# EAGLE board dsp (EAGLE 6.6.0)
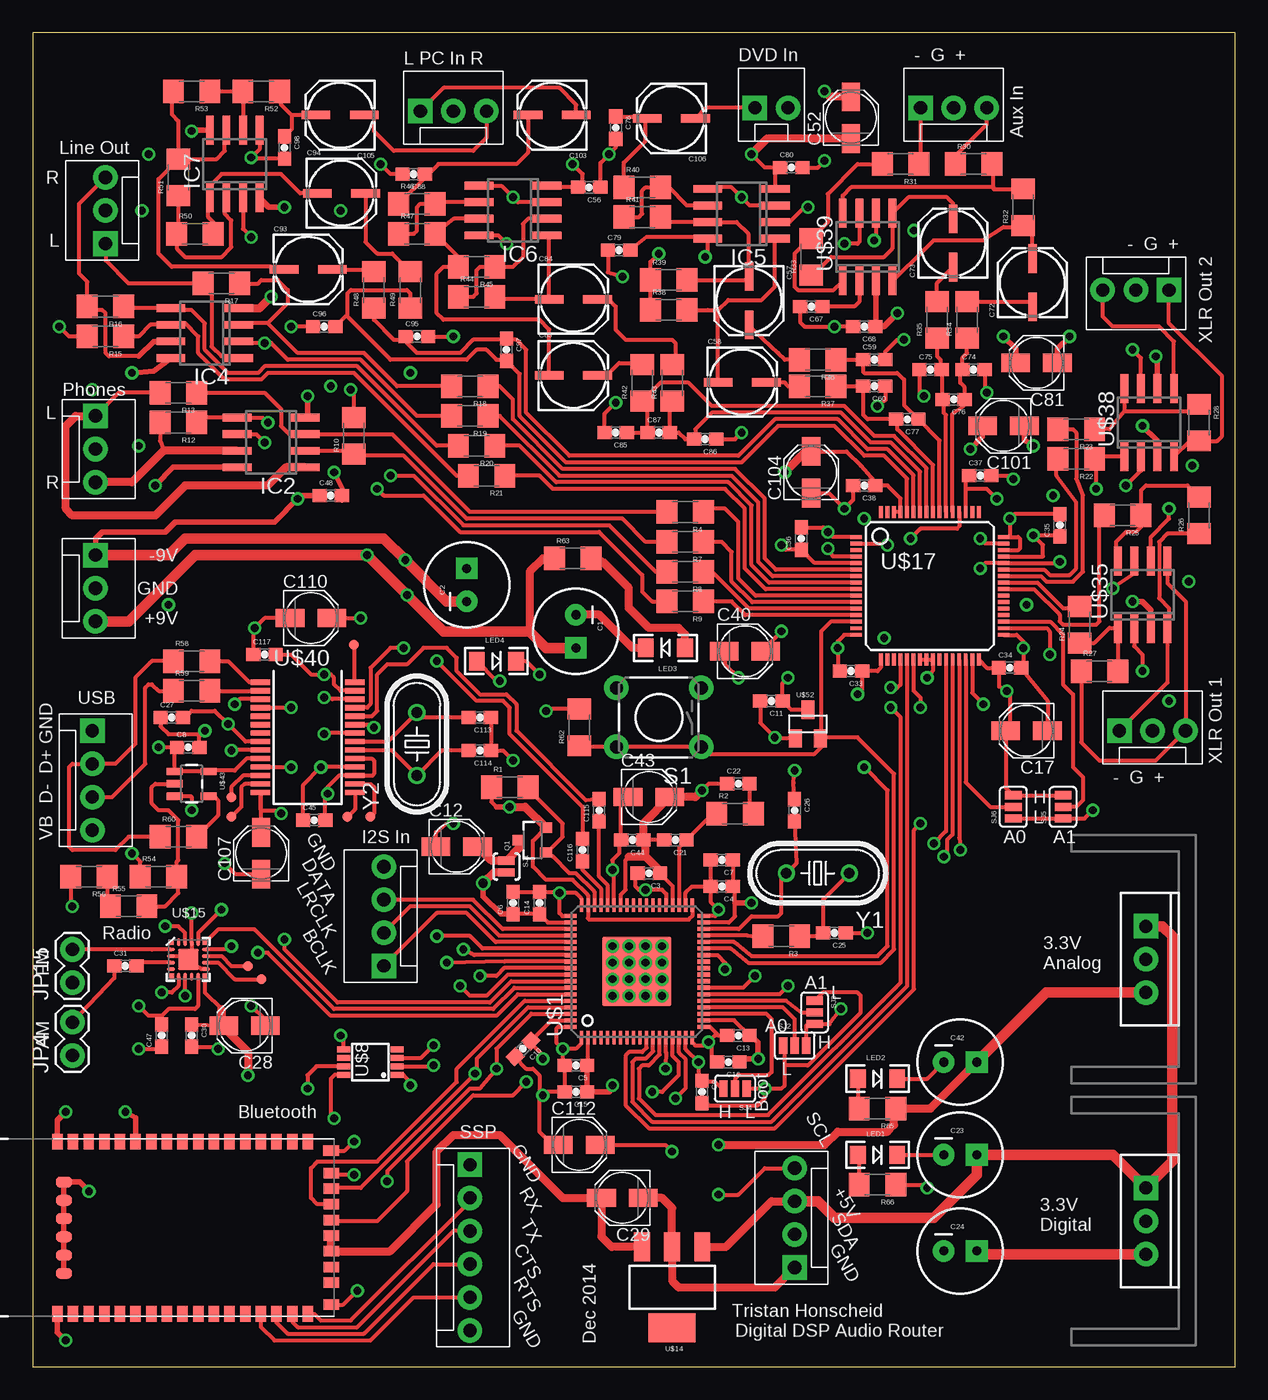
[diagram p2: board, top side]
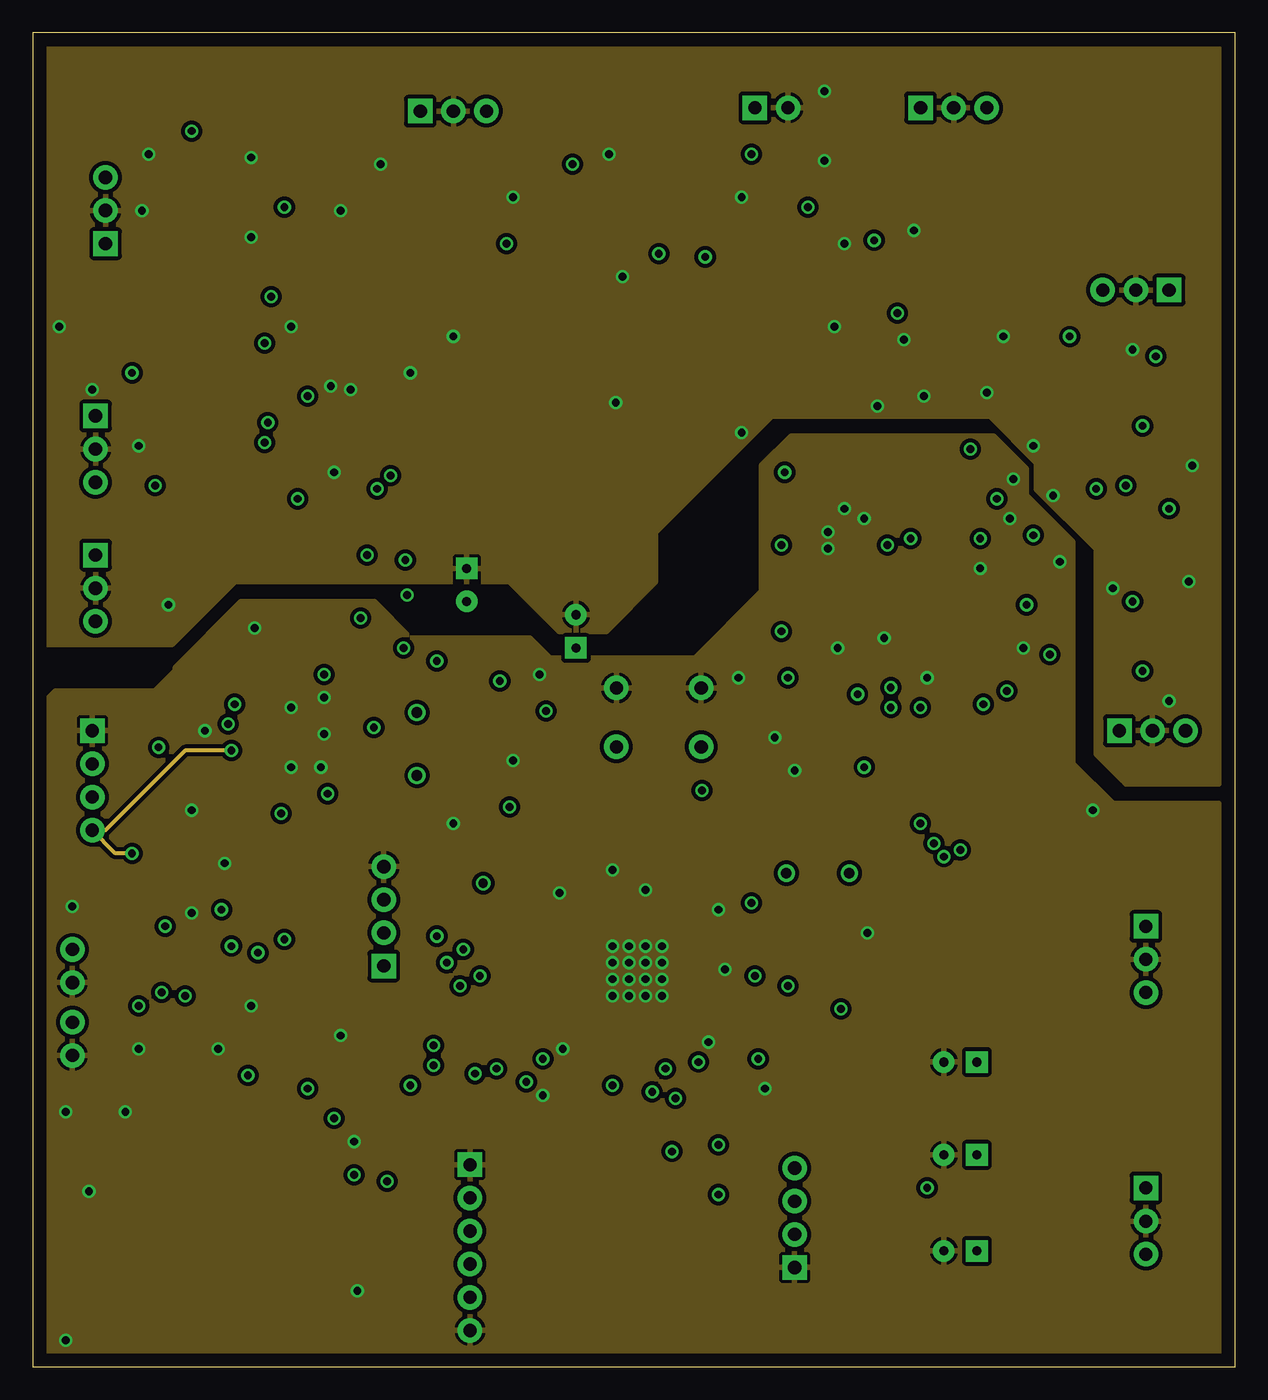
[diagram p3: board, inner layer Route2]
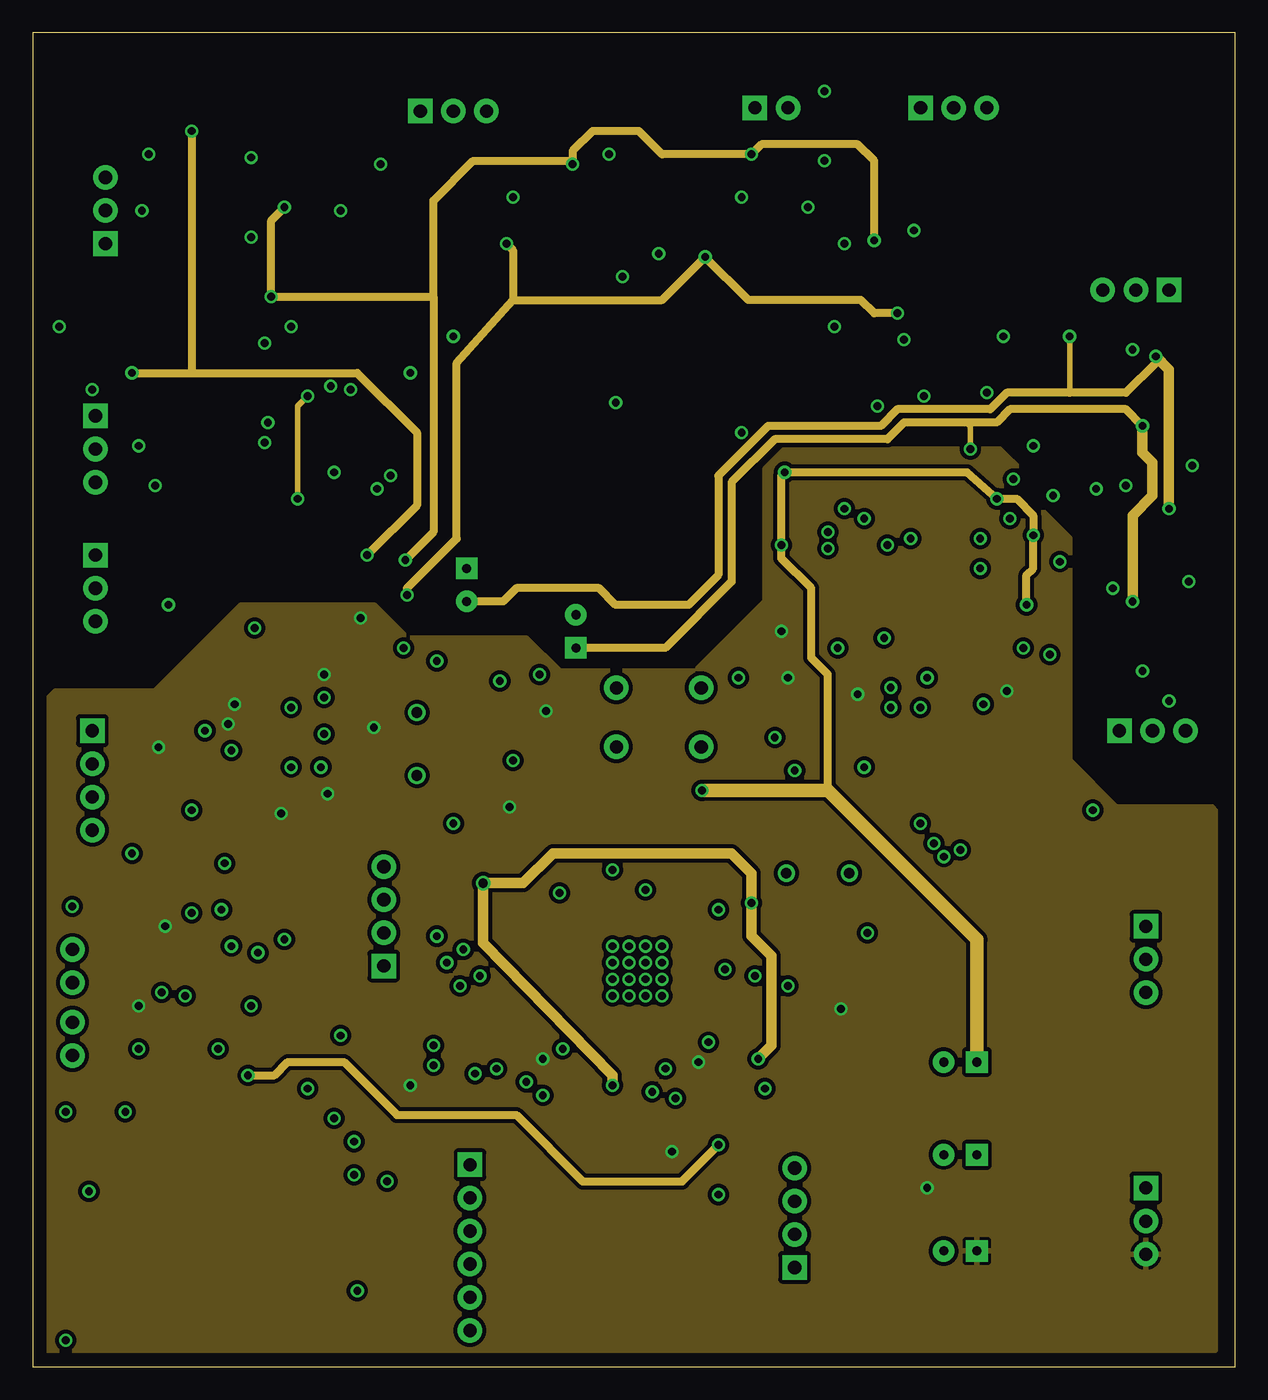
[diagram p4: board, inner layer Route15]
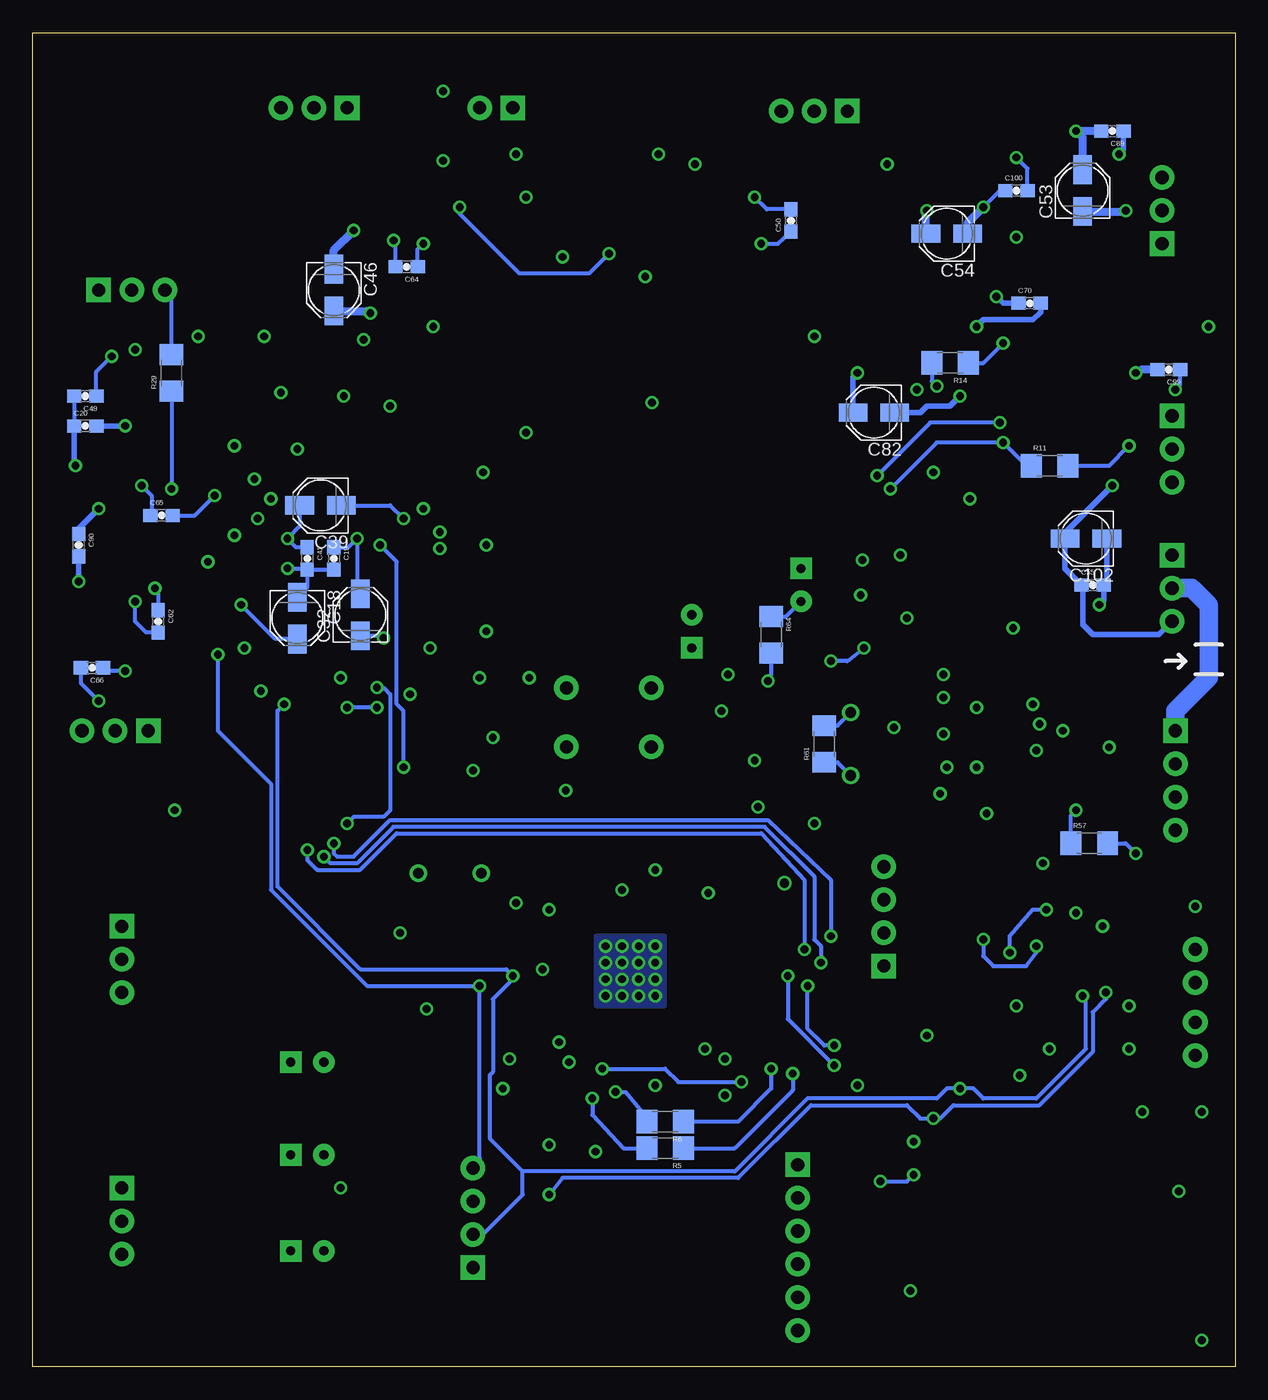
[diagram p5: board, bottom side, seen from below]

Size 92.18 x 102.29 mm. Coordinates in mm from the lower left corner, seen from the top.
Outline: 0,0 92.18,0 92.18,102.29 0,102.29 0,0
Copper layers (1*2*15*16): Top 0.035mm / dielectric 1.5mm / Route2 0.035mm / dielectric 0.15mm / Route15 0.035mm / dielectric 0.2mm / Bottom 0.035mm
Design rules "default *": minimum track width 10mil, minimum drill 15mil, track to track 5mil, track to pad 5mil, pad to pad 5mil, via to via 5mil, smd to smd 5mil, copper to edge 40mil, drill to drill 8mil, minimum pad ring 10mil, minimum via ring 8mil, stop-mask expansion 4mil, vias tented up to drill 0mil, thermal gap 10mil

## Footprints (pad centres in the part's own frame; a part is rotated, then mirrored left to right if it is on the bottom)
CPOL-RADIAL-100UF-25V = drill 0.7 pad 1.651 square: 1 1.27,0 | drill 0.7 pad 1.651: 2 -1.27,0
0603-CAP = smd 1.1 x 1: 1 -0.85,0; 2 0.85,0
PANASONIC_B = smd 2.2 x 1.4: + 1.6,0; - -1.6,0
PANASONIC_C = smd 2.2 x 0.65: + 1.9,-0.2; - -1.8,-0.2
TO220-IGO = drill 1 pad 1.88: GND 0,0; OUT 2.54,0 | drill 1 pad 1.88 square: IN -2.54,0
SO08 = smd 0.6 x 2.2: 1 -1.905,-2.6; 2 -0.635,-2.6; 3 0.635,-2.6; 4 1.905,-2.6; 5 1.905,2.6; 6 0.635,2.6; 7 -0.635,2.6; 8 -1.905,2.6
MOLEX-1X3 = drill 1.016 pad 1.88 square: 1 0,0 | drill 1.016 pad 1.88: 2 2.54,0; 3 5.08,0
MOLEX-1X6 = drill 1.016 pad 1.88 square: 1 0,0 | drill 1.016 pad 1.88: 2 2.54,0; 3 5.08,0; 4 7.62,0; 5 10.16,0; 6 12.7,0
1X02 = drill 1.016 pad 1.88: 1 0,0; 2 2.54,0
MOLEX-1X4 = drill 1.016 pad 1.88 square: 1 0,0 | drill 1.016 pad 1.88: 2 2.54,0; 3 5.08,0; 4 7.62,0
MOLEX-1X2 = drill 1.016 pad 1.88 square: 1 0,0 | drill 1.016 pad 1.88: 2 2.54,0
LED-1206 = smd 1.2 x 1.4: A -1.5,0; C 1.5,0
SOT23-3 = smd 0.8 x 0.9: 1 -0.95,-1; 2 0.95,-1; 3 0,1.1
1206 = smd 1.6 x 1.8: 1 -1.4,0; 2 1.4,0
TACTILE-PTH = drill 1.016 pad 1.88: 1 -3.251,2.261; 2 3.251,2.261; 3 -3.251,-2.261; 4 3.251,-2.261
SJ_2S-NO = smd 0.635 x 1.27: 1 -0.45,0; 2 0.45,0
SJ_3 = smd 0.635 x 1.27: 1 -0.889,0; 2 0,0; 3 0.889,0
PAD.03X.03 = smd 0.762 x 0.762: P$1 0,0
LFCSP-72 = smd 1 x 0.3: 1 5.675,3.65; 2 5.675,3.15; 3 5.675,2.65; 4 5.675,2.15; 5 5.675,1.65; 6 5.675,1.15; 7 5.675,0.65; 8 5.675,0.15; 9 5.675,-0.35; 10 5.675,-0.85; 11 5.675,-1.35; 12 5.675,-1.85; 13 5.675,-2.35; 14 5.675,-2.85; 15 5.675,-3.35; 16 5.675,-3.85; 017 5.675,-4.35; 018 5.675,-4.85; 037 -4.475,-4.85; 038 -4.475,-4.35; 039 -4.475,-3.85; 040 -4.475,-3.35; 041 -4.475,-2.85; 042 -4.475,-2.35; 043 -4.475,-1.85; 044 -4.475,-1.35; 045 -4.475,-0.85; 046 -4.475,-0.35; 047 -4.475,0.15; 048 -4.475,0.65; 049 -4.475,1.15; 050 -4.475,1.65; 051 -4.475,2.15; 052 -4.475,2.65; 053 -4.475,3.15; 054 -4.475,3.65 | smd 0.3 x 1: 019 4.85,-5.725; 020 4.35,-5.725; 021 3.85,-5.725; 022 3.35,-5.725; 023 2.85,-5.725; 024 2.35,-5.725; 025 1.85,-5.725; 026 1.35,-5.725; 027 0.85,-5.725; 028 0.35,-5.725; 029 -0.15,-5.725; 030 -0.65,-5.725; 031 -1.15,-5.725; 032 -1.65,-5.725; 033 -2.15,-5.725; 034 -2.65,-5.725; 035 -3.15,-5.725; 036 -3.65,-5.725; 055 -3.65,4.475; 056 -3.15,4.475; 057 -2.65,4.475; 058 -2.15,4.475; 059 -1.65,4.475; 060 -1.15,4.475; 061 -0.65,4.475; 062 -0.15,4.475; 063 0.35,4.475; 064 0.85,4.475; 065 1.35,4.475; 066 1.85,4.475; 067 2.35,4.475; 068 2.85,4.475; 069 3.35,4.475; 070 3.85,4.475; 071 4.35,4.475; 072 4.85,4.475 | smd 5.3 x 5.3: EXP 0.6,-0.6
MSOP-8 = smd 0.45 x 1: 1 -0.975,-2.05; 2 -0.325,-2.05; 3 0.325,-2.05; 4 0.975,-2.05; 5 0.975,2.05; 6 0.325,2.05; 7 -0.325,2.05; 8 -0.975,2.05
RN-52 = smd 1.2 x 0.8: 1 -6.6,8.33; 2 -6.6,7.13; 3 -6.6,5.93; 4 -6.6,4.73; 5 -6.6,3.53; 6 -6.6,2.33; 7 -6.6,1.13; 8 -6.6,-0.07; 9 -6.6,-1.27; 10 -6.6,-2.47; 11 -6.6,-3.67; 12 -6.6,-4.87; 13 -6.6,-6.07; 14 -6.6,-7.27; 15 -6.6,-8.47; 16 -6.6,-9.67; 25 6.6,-9.67; 26 6.6,-8.47; 27 6.6,-7.27; 28 6.6,-6.07; 29 6.6,-4.87; 30 6.6,-3.67; 31 6.6,-2.47; 32 6.6,-1.27; 33 6.6,-0.07; 34 6.6,1.13; 35 6.6,2.33; 36 6.6,3.53; 37 6.6,4.73; 38 6.6,5.93; 39 6.6,7.13; 40 6.6,8.33; G1 -6.6,9.53; G4 6.6,9.53 | smd 0.8 x 1.2: 17 -4.2,-11.47; 18 -3,-11.47; 19 -1.8,-11.47; 20 -0.6,-11.47; 21 0.6,-11.47; 22 1.8,-11.47; 23 3,-11.47; 24 4.2,-11.47; G2 -5.9,-11.47; G3 5.9,-11.46; RFG1 -3.5,9.03; RFG2 -2.1,9.03; RFG3 -0.7,9.03; RFG4 0.7,9.03; RFG5 2.1,9.03; RFG6 3.5,9.03
SOT223 = smd 1.219 x 2.235: 1 -2.311,-3.099; 2 0,-3.099; 3 2.311,-3.099 | smd 3.6 x 2.2: 4 0,3.099
QFN-16 = smd 0.34 x 0.34: 1 -0.005,-0.005; 6 0.005,-2.535; 11 2.535,-2.535; 16 2.535,-0.005 | smd 0.61 x 0.28: 2 -0.065,-0.52; 3 -0.065,-1.02; 4 -0.065,-1.52; 5 -0.065,-2.02; 12 2.605,-2.02; 13 2.605,-1.52; 14 2.605,-1.02; 15 2.605,-0.52 | smd 0.28 x 0.61: 7 0.52,-2.605; 8 1.02,-2.605; 9 1.52,-2.605; 10 2.02,-2.605; 17 2.02,0.065; 18 1.52,0.065; 19 1.02,0.065; 20 0.52,0.065 | smd 1.6 x 1.6: 21 1.27,-1.27
LQFP-64 = smd 0.9 x 0.3: 1 -5.45,3.68; 2 -5.45,3.18; 3 -5.45,2.68; 4 -5.45,2.18; 5 -5.45,1.68; 6 -5.45,1.18; 7 -5.45,0.68; 8 -5.45,0.18; 9 -5.45,-0.32; 10 -5.45,-0.82; 11 -5.45,-1.32; 12 -5.45,-1.82; 13 -5.45,-2.32; 14 -5.45,-2.82; 15 -5.45,-3.32; 16 -5.45,-3.82; 33 5.85,-3.82; 34 5.85,-3.32; 35 5.85,-2.82; 36 5.85,-2.32; 37 5.85,-1.82; 38 5.85,-1.32; 39 5.85,-0.82; 40 5.85,-0.32; 41 5.85,0.18; 42 5.85,0.68; 43 5.85,1.18; 44 5.85,1.68; 45 5.85,2.18; 46 5.85,2.68; 47 5.85,3.18; 48 5.85,3.68 | smd 0.3 x 0.9: 17 -3.55,-5.72; 18 -3.05,-5.72; 19 -2.55,-5.72; 20 -2.05,-5.72; 21 -1.55,-5.72; 22 -1.05,-5.72; 23 -0.55,-5.72; 24 -0.05,-5.72; 25 0.45,-5.72; 26 0.95,-5.72; 27 1.45,-5.72; 28 1.95,-5.72; 29 2.45,-5.72; 30 2.95,-5.72; 31 3.45,-5.72; 32 3.95,-5.72; 49 3.95,5.58; 50 3.45,5.58; 51 2.95,5.58; 52 2.45,5.58; 53 1.95,5.58; 54 1.45,5.58; 55 0.95,5.58; 56 0.45,5.58; 57 -0.05,5.58; 58 -0.55,5.58; 59 -1.05,5.58; 60 -1.55,5.58; 61 -2.05,5.58; 62 -2.55,5.58; 63 -3.05,5.58; 64 -3.55,5.58
SOIC-8 = smd 0.6 x 2.2: 1 -1.905,-2.6; 2 -0.635,-2.6; 3 0.635,-2.6; 4 1.905,-2.6; 5 1.905,2.6; 6 0.635,2.6; 7 -0.635,2.6; 8 -1.905,2.6
SSOP-28 = smd 0.4 x 1.5: 1 -4.225,-3.625; 2 -3.575,-3.625; 3 -2.925,-3.625; 4 -2.275,-3.625; 5 -1.625,-3.625; 6 -0.975,-3.625; 7 -0.325,-3.625; 8 0.325,-3.625; 9 0.975,-3.625; 10 1.625,-3.625; 11 2.275,-3.625; 12 2.925,-3.625; 13 3.575,-3.625; 14 4.225,-3.625; 15 4.225,3.625; 16 3.575,3.625; 17 2.925,3.625; 18 2.275,3.625; 19 1.625,3.625; 20 0.975,3.625; 21 0.325,3.625; 22 -0.325,3.625; 23 -0.975,3.625; 24 -1.625,3.625; 25 -2.275,3.625; 26 -2.925,3.625; 27 -3.575,3.625; 28 -4.225,3.625
SOT23-5 = smd 0.55 x 1.2: 1 -0.95,-1.3; 2 0,-1.3; 3 0.95,-1.3; 4 0.95,1.3; 5 -0.95,1.3
SOT23 = smd 1 x 1.4: 1 -0.95,-1.1; 2 0.95,-1.1; 3 0,1.1
HC49U-V = drill 0.813: 1 -2.413,0; 2 2.413,0

## Placement (x,y rotation side)
C1  100uF  [CPOL-RADIAL-100UF-25V]  41.66,56.39 270 top
C2  100uF  [CPOL-RADIAL-100UF-25V]  33.27,59.94 90 top
C3  0.1u  [0603-CAP]  47.24,37.85 180 top
C4  0.1uF  [0603-CAP]  52.83,36.83 180 top
C5  0.1uF  [0603-CAP]  41.66,23.11 180 top
C6  1u  [0603-CAP]  36.83,35.56 90 top
C7  1u  [0603-CAP]  52.83,38.86 180 top
C8  0.1uF  [0603-CAP]  11.94,47.5 0 top
C9  0.1uF  [0603-CAP]  51.31,21.08 270 top
C10  0.1uF  [0603-CAP]  37.59,24.38 225 top
C11  0.1uF  [0603-CAP]  56.64,51.05 180 top
C12  10u  [PANASONIC_B]  32.51,39.88 0 top
C13  0.1uF  [0603-CAP]  54.1,25.4 180 top
C14  0.1uF  [0603-CAP]  38.86,35.56 90 top
C15  1u  [0603-CAP]  41.66,21.08 180 top
C16  1u  [0603-CAP]  53.34,23.37 180 top
C17  10u  [PANASONIC_B]  76.2,48.77 180 top
C18  10u  [PANASONIC_B]  71.88,57.4 270 bottom
C19  0.1uF  [0603-CAP]  69.09,61.98 270 bottom
C20  0.1uF  [0603-CAP]  88.14,72.14 0 bottom
C21  150p  [0603-CAP]  49.28,40.39 180 top
C22  5.6nF  [0603-CAP]  54.1,44.7 0 top
C23  100uF  [CPOL-RADIAL-100UF-25V]  71.12,16.26 0 top
C24  100uF  [CPOL-RADIAL-100UF-25V]  71.12,8.89 0 top
C25  22p  [0603-CAP]  61.47,33.27 180 top
C26  22p  [0603-CAP]  58.42,42.67 270 top
C27  0.1u  [0603-CAP]  10.67,49.78 0 top
C28  10u  [PANASONIC_B]  16.26,26.16 180 top
C29  10u  [PANASONIC_B]  45.21,12.95 180 top
C30  0.1uF  [0603-CAP]  12.19,25.4 270 top
C31  0.1uF  [0603-CAP]  7.11,30.73 0 top
C32  10u  [PANASONIC_B]  67.06,57.66 90 bottom
C33  0.1uF  [0603-CAP]  62.74,53.34 180 top
C34  0.1uF  [0603-CAP]  74.93,53.59 0 top
C35  0.1uF  [0603-CAP]  78.74,64.52 90 top
C36  0.1uF  [0603-CAP]  58.93,63.5 90 top
C37  0.1uF  [0603-CAP]  72.64,68.33 0 top
C38  0.1uF  [0603-CAP]  63.75,67.56 180 top
C39  10u  [PANASONIC_B]  70.1,66.04 180 bottom
C40  10u  [PANASONIC_B]  54.61,54.86 0 top
C41  0.1uF  [0603-CAP]  71.12,61.98 270 bottom
C42  100uF  [CPOL-RADIAL-100UF-25V]  71.12,23.37 0 top
C43  10u  [PANASONIC_B]  47.24,43.69 0 top
C44  0.1uF  [0603-CAP]  45.97,40.39 180 top
C45  0.1uF  [0603-CAP]  21.59,41.91 0 top
C46  10u  [PANASONIC_B]  69.09,82.55 270 bottom
C47  0.1uF  [0603-CAP]  9.91,25.4 90 top
C48  0.1uF  [0603-CAP]  22.86,66.8 0 top
C49  0.1uF  [0603-CAP]  88.14,74.42 180 bottom
C50  0.1uF  [0603-CAP]  34.04,87.88 90 bottom
C52  10u  [PANASONIC_B]  62.74,95.76 90 top
C53  10u  [PANASONIC_B]  11.68,90.17 90 bottom
C54  10u  [PANASONIC_B]  22.1,86.87 180 bottom
C55  0.1uF  [0603-CAP]  10.92,59.94 0 bottom
C56  0.1uF  [0603-CAP]  42.67,90.42 180 top
C57  10uF-A  [PANASONIC_C]  55.12,81.79 270 top
C58  10uF-A  [PANASONIC_C]  54.36,75.69 0 top
C59  1n  [0603-CAP]  64.52,77.22 0 top
C60  1n  [0603-CAP]  64.52,75.18 180 top
C62  0.1uF  [0603-CAP]  82.55,57.15 270 bottom
C64  0.1uF  [0603-CAP]  63.5,84.33 180 bottom
C65  0.1uF  [0603-CAP]  82.3,65.28 0 bottom
C66  0.1uF  [0603-CAP]  87.63,53.59 180 bottom
C67  0.1uF  [0603-CAP]  59.69,81.28 180 top
C68  0.1uF  [0603-CAP]  63.75,79.76 180 top
C70  0.1uF  [0603-CAP]  15.75,81.53 0 bottom
C72  10uF-A  [PANASONIC_C]  76.45,83.06 90 top
C73  10uF-A  [PANASONIC_C]  70.36,86.11 90 top
C74  1n  [0603-CAP]  72.14,76.45 0 top
C75  1n  [0603-CAP]  68.83,76.45 0 top
C76  100p  [0603-CAP]  70.61,74.17 180 top
C77  100p  [0603-CAP]  67.06,72.64 180 top
C78  100p  [0603-CAP]  44.7,95 270 top
C79  0.1uF  [0603-CAP]  44.96,85.6 0 top
C80  0.1uF  [0603-CAP]  58.17,91.95 0 top
C81  10u  [PANASONIC_B]  76.96,76.96 180 top
C82  10u  [PANASONIC_B]  27.69,73.15 180 bottom
C83  10uF-A  [PANASONIC_C]  41.4,76.2 0 top
C84  10uF-A  [PANASONIC_C]  41.4,82.04 0 top
C85  1n  [0603-CAP]  44.7,71.63 180 top
C86  1n  [0603-CAP]  51.56,71.12 180 top
C87  100p  [0603-CAP]  48.01,71.63 0 top
C88  100p  [0603-CAP]  29.21,91.44 180 top
C89  0.1uF  [0603-CAP]  9.4,94.74 180 bottom
C90  0.1uF  [0603-CAP]  88.65,62.99 270 bottom
C93  10uF-A  [PANASONIC_C]  21.08,84.33 0 top
C94  10uF-A  [PANASONIC_C]  23.62,90.17 0 top
C95  1n  [0603-CAP]  29.46,78.99 0 top
C96  1n  [0603-CAP]  22.35,79.76 0 top
C97  100p  [0603-CAP]  36.32,77.98 270 top
C98  100p  [0603-CAP]  19.3,93.47 270 top
C99  0.1uF  [0603-CAP]  5.08,76.45 180 bottom
C100  0.1uF  [0603-CAP]  16.76,90.17 0 bottom
C101  10u  [PANASONIC_B]  74.42,72.14 180 top
C102  10u  [PANASONIC_B]  11.43,63.5 180 bottom
C103  10uF-A  [PANASONIC_C]  39.88,95.76 180 top
C104  10u  [PANASONIC_B]  59.69,68.58 90 top
C105  10uF-A  [PANASONIC_C]  23.62,95.76 180 top
C106  10uF-A  [PANASONIC_C]  49.02,95.5 180 top
C107  10u  [PANASONIC_B]  17.53,39.37 90 top
C110  10u  [PANASONIC_B]  21.34,57.4 0 top
C112  10u  [PANASONIC_B]  41.91,17.02 0 top
C113  12p  [0603-CAP]  34.29,49.78 180 top
C114  12p  [0603-CAP]  34.29,47.24 180 top
C115  .1u  [0603-CAP]  43.43,42.67 90 top
C116  .1u  [0603-CAP]  42.16,39.62 90 top
C117  0.1u  [0603-CAP]  17.78,54.61 0 top
IC1  [TO220-IGO]  85.34,11.18 270 top
IC2  OPA2277U  [SO08]  18.29,70.87 90 top
IC3  [TO220-IGO]  85.34,31.24 270 top
IC4  OPA2277U  [SO08]  13.21,79.25 90 top
IC5  OPA2277U  [SO08]  54.36,88.39 90 top
IC6  OPA2277U  [SO08]  36.83,88.65 90 top
IC7  OPA2277U  [SO08]  15.49,92.2 0 top
JP1  +/-9V  [MOLEX-1X3]  4.83,62.23 270 top
JP3  BT UART  [MOLEX-1X6]  33.53,15.49 270 top
JP4  AM Antenna  [1X02]  3.05,23.88 90 top
JP5  Phones  [MOLEX-1X3]  4.83,72.9 270 top
JP6  I2C  [MOLEX-1X4]  58.42,7.62 90 top
JP7  Line Out  [MOLEX-1X3]  5.59,86.11 90 top
JP8  XLR L Out  [MOLEX-1X3]  83.31,48.77 0 top
JP9  XLR R Out  [MOLEX-1X3]  87.12,82.55 180 top
JP10  XLR Aux IN  [MOLEX-1X3]  68.07,96.52 0 top
JP11  DVD In  [MOLEX-1X2]  55.37,96.52 0 top
JP12  PC Input Stereo  [MOLEX-1X3]  29.72,96.27 0 top
JP13  USB Audio  [MOLEX-1X4]  4.57,48.77 270 top
JP14  RPi Audio In  [MOLEX-1X4]  26.92,30.73 90 top
JP15  FM Antenna  [1X02]  3.05,29.46 90 top
LED1  [LED-1206]  64.77,16.26 0 top
LED2  [LED-1206]  64.77,22.1 0 top
LED3  [LED-1206]  48.51,55.12 180 top
LED4  [LED-1206]  35.56,54.1 0 top
Q1  [SOT23-3]  38.35,40.39 90 top
R1  1K  [1206]  36.58,44.45 0 top
R2  4.3K  [1206]  53.85,42.42 0 top
R3  100  [1206]  57.4,33.02 180 top
R4  [1206]  50.04,65.53 180 top
R5  0  [1206]  43.69,16.76 180 bottom
R6  0  [1206]  43.69,18.8 180 bottom
R7  [1206]  50.04,63.25 180 top
R8  [1206]  50.04,60.96 180 top
R9  [1206]  50.04,58.67 180 top
R10  [1206]  24.64,71.37 90 top
R11  [1206]  14.22,69.09 0 bottom
R12  [1206]  11.18,72.39 180 top
R13  [1206]  11.18,74.68 180 top
R14  [1206]  21.84,76.96 180 bottom
R15  [1206]  5.59,78.99 180 top
R16  [1206]  5.59,81.28 180 top
R17  [1206]  14.48,83.06 180 top
R18  [1206]  33.53,75.18 180 top
R19  [1206]  33.53,72.9 180 top
R20  [1206]  34.04,70.61 180 top
R21  [1206]  34.8,68.33 180 top
R22  [1206]  80.01,69.6 180 top
R23  [1206]  80.01,71.88 180 top
R24  [1206]  80.26,56.9 90 top
R25  [1206]  83.57,65.28 180 top
R26  [1206]  89.41,65.28 90 top
R27  [1206]  81.79,53.34 0 top
R28  [1206]  89.41,72.39 270 top
R29  [1206]  81.53,76.2 90 bottom
R30  [1206]  72.14,92.2 0 top
R31  [1206]  66.55,92.2 180 top
R32  [1206]  75.95,88.9 90 top
R33  [1206]  59.69,85.09 90 top
R34  200  [1206]  71.63,80.26 90 top
R35  200  [1206]  69.34,80.26 90 top
R36  200  [1206]  60.2,77.22 180 top
R37  200  [1206]  60.2,75.18 180 top
R38  4.7K  [1206]  48.77,81.03 0 top
R39  4.7K  [1206]  48.77,83.31 0 top
R40  4.7K  [1206]  46.74,90.42 0 top
R41  4.7K  [1206]  46.74,88.14 0 top
R42  200  [1206]  46.74,75.44 90 top
R43  200  [1206]  49.02,75.44 90 top
R44  4.7K  [1206]  34.04,82.04 0 top
R45  4.7K  [1206]  34.04,84.33 180 top
R46  4.7K  [1206]  29.46,89.15 0 top
R47  4.7K  [1206]  29.46,86.87 0 top
R48  200  [1206]  26.16,82.55 90 top
R49  200  [1206]  28.96,82.55 90 top
R50  4.7K  [1206]  12.45,86.87 0 top
R51  4.7K  [1206]  11.18,91.19 90 top
R52  4.7K  [1206]  17.53,97.79 180 top
R53  4.7K  [1206]  12.19,97.79 180 top
R54  4.7K  [1206]  9.65,37.59 0 top
R55  4.7K  [1206]  7.37,35.31 0 top
R56  4.7K  [1206]  4.32,37.59 180 top
R57  1M  [1206]  11.18,40.13 0 bottom
R58  22  [1206]  12.19,54.1 0 top
R59  22  [1206]  12.19,51.82 0 top
R60  1.5K  [1206]  11.18,40.64 0 top
R61  1M  [1206]  31.5,47.75 90 bottom
R62  10K  [1206]  41.91,49.02 90 top
R63  1K  [1206]  41.4,61.98 0 top
R64  1K  [1206]  35.56,56.13 270 bottom
R65  160  [1206]  64.77,19.81 180 top
R66  160  [1206]  64.77,13.97 180 top
S1  [TACTILE-PTH]  48.01,49.78 180 top
SJ1  1.2V Test  [SJ_2S-NO]  36.32,38.35 270 top
SJ2  A0  [SJ_3]  58.42,24.64 0 top
SJ3  A1  [SJ_3]  59.94,27.18 270 top
SJ4  Boot  [SJ_3]  53.85,21.34 180 top
SJ5  A1  [SJ_3]  78.99,42.93 90 top
SJ6  A1  [SJ_3]  75.18,42.93 90 top
TP2  FM L test  [PAD.03X.03]  16.51,30.73 0 top
TP3  FM R test  [PAD.03X.03]  17.53,29.72 0 top
TP4  VOUT-L  [PAD.03X.03]  25.91,42.16 0 top
TP5  VOUT-R  [PAD.03X.03]  24.13,42.16 0 top
TP6  VIN-L  [PAD.03X.03]  15.24,43.69 0 top
TP7  VIN-R  [PAD.03X.03]  15.24,42.16 0 top
TP8  Suspend  [PAD.03X.03]  24.64,55.37 0 top
U$1  ADAU1451  [LFCSP-72]  45.72,29.72 90 top
U$8  ADM1032  [MSOP-8]  25.91,23.37 90 top
U$13  BLUETOOTH-RN-52  [RN-52]  11.43,10.67 90 top
U$14  3.3V Reg.  [SOT223]  49.02,6.1 180 top
U$15  SI4736/37/38/39  [QFN-16]  10.67,32.51 0 top
U$17  AD1937  [LQFP-64]  68.58,59.94 0 top
U$35  LME49724  [SOIC-8]  85.09,59.18 0 top
U$38  LME49724  [SOIC-8]  85.6,72.39 0 top
U$39  LME49724  [SOIC-8]  64.01,85.85 0 top
U$40  PCM2903  [SSOP-28]  21.08,48.26 270 top
U$43  74AHC1G08  [SOT23-5]  12.19,44.7 270 top
U$52  TLV803  [SOT23]  59.44,49.28 0 top
Y1  12.288MHz  [HC49U-V]  60.2,37.85 180 top
Y2  12MHz  [HC49U-V]  29.46,47.75 90 top

## Tracks (layer width: path | path; a pad name or v marks a point on that pad's centre or on a via)
1.0V  (via drill 0.6, 0.7)
  Top 0.305: C5.1 42.57,23.13 U$1.053 | C6.1 C14.1 39.5,34.07 U$1.071 | C7.1 C4.1 53.85,36.66 53.85,35.56 53.85,34.54 53.37,34.07 U$1.020 | C13.1 53.78,26.57 U$1.035
  Top 0.406: C5.1 C15.1 44.2,21.08 44.45,21.34 v44.45,21.59 | C6.1 35.9,34.71 34.54,36.07 v34.54,37.08 | 53.85,35.56 v55.12,35.56 | C16.1 54.19,23.62 v55.63,23.62 55.63,24.89 55.12,25.4 C13.1
  Top 0.61: SJ1.2 35.36,37.9 v34.54,37.08
  Route15 0.813: v55.63,23.62 56.64,24.64 56.64,31.5 55.12,33.02 v55.12,35.56 55.12,37.85 53.59,39.37 39.88,39.37 37.59,37.08 v34.54,37.08 34.54,32.51 44.45,22.35 v44.45,21.59
3.3V_A  (via drill 0.6)
  Top 0.305: U$17.45 77.45,62.12 77.45,63.01 v76.71,63.75 78.65,63.75 C35.1 | U$17.51 71.53,67.31 | 71.53,67.31 71.53,68.06 C37.1 | U$17.62 U$17.61 66.53,66.57 65.53,67.56 C38.1 64.77,67.65 63.5,69.09 62.41,70.18 C104.+ | U$15.11 13.2,28.71 14.48,27.43 14.48,26.34 C28.+ C30.1 | 46.99,40.22 C44.1 C21.2 | 48.09,38.01 C3.1 49.07,36.87 U$1.15 | 45.72,39.12 45.47,38.86 45.47,36.58 45.07,36.18 U$1.7 | C22.1 51.82,44.7 v51.31,44.2 | U$17.5 59.95,61.62 C36.1 57.75,62.65 v57.4,62.99 | v73.91,66.55 73.15,67.31 71.53,67.31
  Top 0.61: 45.72,39.12 46.99,39.12 | 46.99,39.12 46.99,40.22 | 48.09,38.01 46.99,39.12 | C44.1 46.82,41.67 C43.+ 50.8,43.69 v51.31,44.2 | 14.48,27.43 14.48,26.16 16.51,24.13 v16.51,22.35 | C104.+ 59.26,70.18 v57.66,68.58 | C42.1 68.83,19.81 R65.1 66.04,19.68 66.04,18.54 65.53,18.03 61.72,18.03 60.71,17.02 v52.58,17.02
  Top 0.813: IC3.OUT 77.72,28.7 C42.1
  Route15 0.61: 60.96,44.2 60.96,53.09 59.69,54.36 59.69,59.69 57.4,61.98 v57.4,62.99 57.4,68.33 v57.66,68.58 71.63,68.58 v73.91,66.55 75.44,66.55 76.71,65.28 v76.71,63.75 76.71,61.21 76.2,60.71 v76.2,58.42 | v16.51,22.35 18.54,22.35 19.56,23.37 23.88,23.37 27.94,19.3 37.08,19.3 42.16,14.22 49.78,14.22 v52.58,17.02
  Route15 1.016: C42.1 72.39,32.77 60.96,44.2 v51.31,44.2
  Bottom 0.305: C18.+ 73.58,55.8 v76.2,58.42
3V3_D  (via drill 0.6)
  Top 0.305: U$17.17 65.03,53.6 64.77,53.34 C33.1 63.59,51.9 v63.25,51.56 | U$15.10 12.69,27.67 12.45,27.43 10.41,27.43 9.91,26.92 | 9.91,26.92 C47.2 | U$17.32 73.15,53.59 C34.1 74.08,52.16 v74.68,51.82 74.93,51.56 74.93,48.95 C17.+ 74.6,44.4 SJ6.3 SJ5.3 | U$40.10 16.41,46.63 15.49,45.72 13.56,45.72 U$43.5 U$43.1 10.89,47.3 C8.1 v9.65,47.5 | Q1.2 38.35,40.34 38.35,38.35 39.37,37.34 41.4,37.34 42.57,36.17 U$1.2 42.57,34.39 42.67,34.29 50.29,34.29 50.57,34.57 U$1.018 | R1.1 35.18,43.31 35.56,42.93 | C107.+ 17.53,42.67 | 17.53,42.67 17.53,43.97 U$40.14 17.46,42.74 17.53,42.67 | v39.12,23.62 39.12,23.88 38.19,24.8 C10.1 39.78,26.57 U$1.056 | SJ4.3 52.83,21.34 52.32,21.84 51.4,21.84 C9.1 51.05,22.19 v51.05,23.37 50.07,24.35 U$1.038 | v61.98,27.43 61.09,26.29 SJ3.3 59.31,26.16 SJ2.3 | U$15.19 11.69,33.27 11.18,33.78 v10.16,33.78 | 9.91,26.92 8.89,26.92 v8.13,27.69 | U$8.1 28.41,22.39 28.96,21.84 v28.96,21.59 | U$52.3 58.17,50.38 C11.1 57.49,52.41 v57.91,52.83 | U$40.8 16.33,47.94 v14.99,49.28 13.97,50.29 12.19,50.29 11.68,49.78 C27.2 | U$40.3 15.88,51.19 v15.49,50.8 | 17.53,42.67 18.8,42.67 v19.05,42.42 | U$40.19 26.01,46.63 26.16,46.48 26.16,45.47 26.03,45.34 U$40.17 23.49,45.34 22.61,44.45 v22.61,43.94 22.44,43.78 C45.2 | U$40.23 25.95,49.23 v26.16,49.02 | U$40.27 23.6,51.84 23.11,52.32 23.11,52.83 22.86,53.09 v22.35,53.09 21.34,53.09 19.81,54.61 C117.2 | C110.+ v25.15,57.4 | C112.+ 48.51,17.02 v49.02,16.51 | R62.2 39.5,50.42 v39.37,50.29 | C40.+ 56.21,55.19 v57.4,56.39 | R66.1 68.33,13.97 v68.58,13.72
  Top 0.406: 35.56,42.93 v36.58,42.93
  Top 0.61: v36.58,42.93 37.76,42.93 Q1.2
  Top 0.813: IC1.OUT 72.64,8.64 C24.1
  pour Route15 (isolate 0.305): 1.27,51.31 1.78,51.82 9.4,51.82 16,58.42 26.16,58.42 28.7,55.88 37.85,55.88 40.39,53.34 50.8,53.34 56.13,58.67 56.13,68.83 57.66,70.36 74.17,70.36 75.95,68.58 75.95,67.06 79.5,63.5 79.5,46.48 83.06,42.93 90.42,42.93 90.68,42.67 90.68,1.27 1.02,1.27 1.02,51.05
5V
  Top 0.61: U$14.1 53.14,9.2 56.64,12.7 JP6.3
  Top 0.813: IC3.IN 86.61,33.78 87.38,33.02 87.38,15.75 IC1.IN 82.8,16.26 C23.1 72.39,14.73 69.09,11.43 61.47,11.43 60.2,12.7 JP6.3
!RESET
  Top 0.305: U$52.2 60.45,48.24 60.45,56.39 61.19,57.12 U$17.14 | U$52.2 60.47,48.26 63.25,48.26 66.04,45.47 66.04,32 65.02,30.99 54.86,30.99 53.53,32.07 U$1.024 | U$52.2 60.45,48.11 60.45,47.5 59.94,46.99 51.82,46.99 51.28,47.52 S1.1 S1.2 42.01,47.52 R62.1
BCLK0  (via drill 0.6)
  Top 0.305: v27.18,14.22 27.18,14.99 33.53,21.34 34.29,21.34 v35.56,22.86 35.56,24.38 38.24,27.07 U$1.057 | v24.64,14.73 23.04,14.73 U$13.24
  Bottom 0.305: v27.18,14.22 25.15,14.22 v24.64,14.73 | v35.56,22.86 35.56,21.34 38.1,18.8 R6.1
BCLK1  (via drill 0.6)
  Top 0.305: v17.27,31.75 18.03,31.75 22.86,26.92 35.56,26.92 37.2,28.57 U$1.060 | v14.48,35.05 12.7,33.27 U$15.17
  Bottom 0.305: v17.27,31.75 17.27,33.02 15.49,35.05 v14.48,35.05
BCLK2  (via drill 0.6)
  Top 0.305: U$17.28 70.53,40.81 70.1,40.39 70.1,39.37 v69.85,39.12 | v31.75,30.99 36.15,31.07 U$1.065
  Bottom 0.305: v69.85,39.12 69.34,38.61 67.31,38.61 64.52,41.4 36.07,41.4 32.26,37.59 32.26,32.77 31.75,32.26 v31.75,30.99
BCLK3
  Top 0.305: JP14.1 30.99,34.8 33.27,34.8 35.5,32.57 U$1.068
BCLK_OUT0  (via drill 0.6)
  Top 0.305: v47.5,21.08 48.26,21.08 49.53,22.35 49.53,23.37 49.07,23.83 U$1.040
  Bottom 0.305: v47.5,21.08 46.74,21.08 45.47,19.56 R6.2
BCLK_OUT1
  Top 0.305: U$17.21 67.03,29.18 56.64,18.8 47.5,18.8 45.97,20.32 45.97,23.37 46.23,23.62 46.99,23.62 47.57,24.2 U$1.043
BT_CTS
  Top 0.305: U$13.14 18.7,3.4 19.56,2.54 25.4,2.54 30.73,7.87 JP3.4
BT_RTS
  Top 0.305: U$13.13 17.5,3.07 18.54,2.03 25.91,2.03 29.21,5.33 JP3.5
BT_RXI
  Top 0.305: U$13.16 21.33,4.07 21.34,4.06 21.59,4.06 22.1,3.56 24.38,3.56 33.53,12.7 JP3.2
BT_TXO
  Top 0.305: U$13.15 19.9,3.47 20.32,3.05 24.89,3.05 32.26,10.41 JP3.3
CLOCK  (via drill 0.6)
  Top 0.305: v63.75,45.97 65.53,44.2 65.53,32.26 64.77,31.5 55.12,31.5 53.79,32.57 U$1.023 | U$17.2 65.4,63.12 v65.53,62.99
  Bottom 0.305: v63.75,45.97 63.75,50.29 64.26,50.8 64.26,61.72 v65.53,62.99
DAC3L0
  Top 0.305: R18.1 35.81,75.18 36.83,74.17 36.83,72.64 40.64,68.83 53.85,68.83 56.13,66.55 56.13,61.98 56.99,61.12 U$17.6
DAC3L1
  Top 0.305: R19.1 35.81,72.9 40.39,68.33 53.59,68.33 55.63,66.29 55.63,61.72 56.72,60.62 U$17.7
DAC3R0
  Top 0.305: R20.1 37.34,70.61 40.13,67.82 53.34,67.82 55.12,66.04 55.12,61.47 56.46,60.12 U$17.8
DAC3R1
  Top 0.305: U$17.9 56.2,59.62 54.61,61.21 54.61,65.79 53.09,67.31 39.88,67.31 38.86,68.33 R21.1
DAC4L0
  Top 0.305: U$17.10 55.43,59.12 54.1,60.45 54.1,64.77 53.09,65.79 51.69,65.79 R4.1
DAC4L1
  Top 0.305: U$17.11 55.17,58.62 53.59,60.2 53.59,62.48 52.83,63.25 R7.1
DAC4R0
  Top 0.305: U$17.12 54.91,58.12 52.07,60.96 R8.1
DAC4R1
  Top 0.305: U$17.13 54.64,57.62 53.59,58.67 R9.1
DATA0
  Top 0.305: U$13.22 21.82,12.47 21.34,12.95 21.34,15.24 21.84,15.75 26.42,15.75 32.51,21.84 32.51,22.86 37.72,28.07 U$1.059
DATA1  (via drill 0.6)
  Top 0.305: v19.3,32.77 19.3,32 23.37,27.94 35.05,27.94 36.68,29.57 U$1.062 | v15.24,32.26 14.81,32 U$15.15
  Bottom 0.305: v19.3,32.77 19.3,31.5 18.54,30.73 16,30.73 15.24,31.75 v15.24,32.26
DATA2  (via drill 0.6)
  Top 0.305: U$17.27 70.03,41.07 v69.09,40.13 | v30.99,33.02 33.53,33.02 34.48,32.07 U$1.067
  Bottom 0.305: v69.09,40.13 69.09,39.37 68.83,39.12 67.56,39.12 64.77,41.91 35.81,41.91 30.99,37.34 v30.99,33.02
DATA3
  Top 0.305: JP14.3 33.78,35.81 36.03,33.57 U$1.070
DATA_OUT0  (via drill 0.6)
  Top 0.305: v48.51,22.86 48.51,23.11 48.57,24.07 U$1.041 | U$13.21 22.99,11.18 26.42,11.18 28.7,13.46 28.7,15.75 33.78,20.83 36.83,20.83 v37.85,21.84
  Bottom 0.305: v48.51,22.86 43.69,22.86 42.67,21.84 v37.85,21.84
DATA_OUT1  (via drill 0.6)
  Top 0.305: U$17.20 66.53,52.31 66.29,52.07 v65.79,52.07 | v68.07,41.66 67.56,41.15 67.56,28.96 56.9,18.29 47.24,18.29 45.47,20.07 45.47,23.88 45.72,24.13 46.74,24.13 47.07,24.46 U$1.044
  Bottom 0.305: v65.79,52.07 65.28,52.07 64.77,51.56 64.77,42.67 65.28,42.16 67.56,42.16 v68.07,41.66
FILTER  (via drill 0.6)
  Top 0.305: U$17.47 73.02,63.12 v72.64,63.5
  Bottom 0.305: C41.1 71.97,62.83 v72.64,63.5 71.7,64.44 C39.+
FM
  Top 0.305: U$15.2 9.16,31.99 8.64,32 JP15.2
GND  (via drill 0.6)
  Top 0.305: U$17.16 62.22,56.12 61.72,55.63 v61.72,55.12 61.72,53.51 C33.2 | U$17.23 U$17.24 U$17.25 69.03,53.4 v68.58,52.83 | U$17.33 75.45,56.12 75.95,55.63 v75.95,55.12 75.95,53.25 C34.2 77.81,51.04 C17.- | U$17.4 61.36,62.12 v60.96,62.74 | U$17.1 61.34,63.62 v60.96,64.01 60.62,64.35 C36.2 | v78.74,61.72 78.64,61.62 U$17.44 73.05,61.62 v72.64,61.21 | C37.2 74.93,68.33 v75.18,68.07 | U$40.4 19.8,50.53 v19.81,50.55 | U$40.26 22.98,51.19 v22.35,51.31 | U$40.11 19.8,45.98 v19.81,45.97 | U$40.22 22.42,48.59 v22.35,48.51 | U$15.12 12.94,30.49 12.45,30.73 U$15.21 | U$15.3 11.69,31.49 U$15.21 | U$15.21 12.19,31.49 U$15.18 12.19,34.03 v12.19,34.8 | U$13.G3 23.93,16.57 v24.64,17.27 | C30.2 14.06,24.55 v14.22,24.38 | v8.13,24.38 9.74,24.38 C47.1 | v40.39,36.32 41.66,36.32 42.07,35.91 U$1.1 | v40.39,36.32 40.39,34.8 40.62,34.57 U$1.072 | U$43.3 12.13,43.75 12.19,43.69 v12.19,42.67 | C107.- 15.57,37.77 v14.73,38.61 | R56.2 2.92,35.44 v3.05,35.31 | U$8.5 23.86,25.16 v23.62,25.4 | C26.1 58.33,44.79 v58.42,45.72 | C12.- 30.91,40.97 31.75,41.66 v32.26,41.66 | v36.83,46.48 36.07,47.24 C114.1 C113.1 | U$52.1 56.98,48.18 v56.9,48.26 55.79,49.36 C11.2 | C25.1 v64.01,33.27 | C74.2 72.99,74.84 v73.15,74.68 | C75.1 67.98,74.76 v68.33,74.42 | U$39.7 63.37,86.23 63.25,86.11 v62.23,86.11 | C68.2 v61.47,79.76 59.18,79.76 58.84,80.1 C67.2 | C59.2 65.37,77.81 66.29,78.74 v66.8,78.74 | C60.1 65.37,74.08 v64.77,73.66 | IC5.5 51.88,90.42 53.59,90.42 v54.36,89.66 54.99,89.03 IC5.3 | C78.2 44.7,93.47 v44.2,92.96 43.52,92.29 C56.1 | C80.2 60.2,91.95 v60.71,92.46 | C79.1 44.11,83.91 v45.21,83.57 | C86.1 53.85,71.12 v54.36,71.63 | C85.2 43.85,73.06 v44.7,73.91
  Top 0.305: IC6.5 35.94,90.55 v36.83,89.66 37.21,89.28 IC6.3 | IC7.5 17.4,93.34 v16.76,92.71 16.85,92.62 C98.2 | IC7.3 16.13,87.25 v16.76,86.61 | C95.2 v32.26,78.99 | C96.1 v19.81,79.76 | C104.- 61.04,66.98 v62.23,65.79 62.9,66.46 C38.2 | R15.2 2.79,78.99 v2.03,79.76 | R10.2 24.64,74.68 v24.38,74.93 | U$38.7 84.96,77.34 v84.33,77.98 | U$35.7 84.45,60.83 v82.8,59.69 | SJ6.1 SJ5.1 80.64,42.04 v81.28,42.67 | U$13.G2 23.82,4.77 v24.89,5.84 | C88.2 27.43,91.44 v26.67,92.2 | C3.2 46.23,37.68 46.23,36.83 46.48,36.58 v46.99,36.58 48.26,36.58 48.57,36.27 U$1.14 | C43.- 45.12,43.17 C44.2 44.96,40.22 44.96,39.37 44.45,38.86 v44.45,38.1 44.57,37.98 U$1.6 | C5.2 C15.2 39.37,21.08 v39.12,20.83 | C6.2 C14.2 40.3,36.41 v40.39,36.32 | C4.2 51.98,35.65 v52.58,35.05 52.35,34.57 U$1.019 | C7.2 C4.2 | 60.07,27.94 SJ3.1 60.58,28.7 63.25,28.7 63.5,28.45 63.5,27.18 59.44,23.11 57.66,23.11 | SJ4.1 v56.13,21.34 | v56.13,21.34 57.4,21.34 57.66,21.59 57.66,23.11 | C10.2 36.99,23.71 37.85,22.86 38.35,22.86 38.86,22.35 38.86,21.08 v39.12,20.83 | 40.55,22.86 C5.2 | C9.2 51.65,20.23 51.82,20.07 55.63,20.07 56.13,20.57 v56.13,21.34 | 52.58,25.4 51.91,26.07 U$1.036 | 52.58,25.4 C13.2 | C16.2 52.07,23.37 52.07,24.64 v51.82,24.89 | 52.58,25.4 52.32,25.4 v51.82,24.89 | 57.66,23.11 57.66,24.51 SJ2.1 | v51.82,24.89 51.56,24.64 50.8,24.64 50.57,24.87 U$1.037 | C28.- 17.86,26.59 v16.76,27.69 | C8.2 12.79,48.35 | 12.79,48.35 v13.21,48.77 | C45.1 20.74,44.62 v22.1,45.97 22.11,45.98 U$40.18 | C110.- 17.78,57.4 v17.02,56.64 16.93,56.55 C117.1 | C112.- 39.88,17.02 38.86,18.03 38.86,20.57 v39.12,20.83 | C27.1 9.82,49.11 10.41,48.51 12.62,48.51 12.79,48.35
  Top 0.305: C40.- 53.09,53.85 v54.1,52.83 | U$17.46 75.58,62.62 75.69,62.74 75.69,63.5 75.57,63.62 74.93,63.62 | U$17.48 74.93,63.62 | 74.93,63.62 v74.93,65.02 75.27,65.37 C35.2 | LED4.C 37.85,54.1 v38.86,53.09 | LED2.C 68.58,22.1 C42.2 | LED1.C C23.2 | v40.64,24.38 41.66,24.38 42.07,24.8 U$1.054 | v40.64,24.38 40.64,23.28 C5.2 | v40.64,24.38 40.13,24.89 40.13,25.91 40.29,26.07 U$1.055 | U$1.017 50.07,36.35 50.55,36.83 C4.2 | U$1.025 52.51,31.57 53.09,30.99 v53.09,30.48 | U$1.EXP v45.72,29.72
  Top 0.406: U$13.G1 1.9,2.67 v2.54,2.03 | U$13.RFG1 U$13.RFG2 U$13.RFG3 U$13.RFG4 U$13.RFG5 U$13.RFG6 3.61,14.17 v4.32,13.46 | U$13.G4 1.9,18.92 v2.54,19.56 | U$13.36 7.9,19.08 v7.11,19.56 | C48.2 23.71,66.46 23.88,67.06 v23.11,68.58 | C101.- 76.02,71.04 v76.71,70.61 | C81.+ 75.36,78.05 v74.42,78.99
  Top 0.61: C29.- 48.26,12.95 49.02,12.19 U$14.2 49.02,6.6 49.53,6.1 56.9,6.1 JP6.1 | C52.+ 61.14,97.36 v60.71,97.79 | LED3.C 45.97,55.12 43.43,57.66 C1.2
  Bottom 0.305: R14.2 23.24,75.57 v22.86,75.18 | R11.2 9.65,69.09 v8.13,70.61 | C66.2 88.48,52.41 v87.12,51.05 | C65.2 79.76,65.28 v78.23,66.8 | C49.2 C20.1 | C99.1 4.23,75.27 v4.57,74.93 | C100.2 15.91,91.86 v16.76,92.71 | C50.2 35.9,88.73 v36.83,89.66 | C64.1 62.65,85.69 v62.23,86.11 | v82.8,59.69 82.55,59.18 C62.1 | R57.1 12.58,42.29 v12.19,42.67 | C41.2 C19.2 | v72.64,61.21 71.21,61.21 C41.2 | C41.2 71.12,59.77 C18.- | C32.- 65.46,56.06 v65.28,55.88 | C39.- 64.77,66.04 v63.75,65.02
  Bottom 0.406: C20.1 88.99,69.18 v88.9,69.09 | C90.2 v88.65,60.2 | C82.+ 29.29,75.87 v28.96,76.2 | C102.- 9.83,60.19 C55.2 10.07,58.76 v10.41,58.42 | C89.1 8.55,93.31 v8.89,92.96 | C70.2 14.9,80.86 15.49,80.26 19.3,80.26 v19.81,79.76
  Bottom 0.61: C54.+ 23.7,88.57 v23.62,88.65 | C46.- 69.09,85.6 v67.56,87.12 | C53.- 8.46,88.57 v8.38,88.65
  Bottom 1.422: JP13.1 4.57,50.29 2.03,52.83 2.03,58.42 3.3,59.69 JP1.2
  other vias: 44.45,32.26 45.72,32.26 46.99,32.26 48.26,32.26 44.45,30.99 45.72,30.99 46.99,30.99 48.26,30.99 44.45,29.72 46.99,29.72 48.26,29.72 44.45,28.45 45.72,28.45 46.99,28.45 48.26,28.45
  pour Bottom (no thermals): 43.69,33.02 49.02,33.02 49.02,27.69 43.69,27.69
  pour Route2 (isolate 0.305): 90.93,44.7 90.93,101.09 0.76,101.09 0.76,55.37 10.67,55.37 15.49,60.2 36.58,60.2 40.39,56.39 43.94,56.39 47.75,60.2 47.75,64.01 55.88,72.14 56.64,72.9 73.41,72.9 76.96,69.34 76.96,67.31 81.53,62.74 81.53,46.99 83.57,44.96 83.82,44.7
  pour Route2 (isolate 0.305): 90.93,43.18 82.8,43.18 79.76,46.23 79.76,63.25 76.2,66.8 76.2,68.83 73.66,71.37 58.17,71.37 55.88,69.09 55.88,59.44 50.8,54.36 39.62,54.36 38.1,55.88 28.96,55.88 26.16,58.67 16,58.67 10.92,53.59 10.92,53.34 9.4,51.82 1.78,51.82 0.76,50.8 0.76,1.02 1.02,0.76 90.93,0.76
LRCLK0  (via drill 0.6)
  Top 0.305: U$13.23 22.95,13.72 25.15,13.72 v33.91,22.48 34.04,22.86 34.04,23.62 37.98,27.57 U$1.058
  Bottom 0.305: R5.1 38.35,16.76 33.91,21.21 v33.91,22.48
LRCLK1
  Top 0.305: U$15.16 14.22,33.53 17.02,33.53 23.11,27.43 35.31,27.43 36.94,29.07 U$1.061
LRCLK2  (via drill 0.6)
  Top 0.305: U$17.29 71.03,40.55 71.12,39.88 v71.12,39.62 | v33.02,32 33.85,31.57 U$1.066
  Bottom 0.305: v71.12,39.62 71.12,38.86 70.36,38.1 67.06,38.1 64.26,40.89 36.32,40.89 33.02,37.34 v33.02,32
LRCLK3
  Top 0.305: JP14.2 28.96,35.31 33.53,35.31 35.77,33.07 U$1.069
LRCLK_OUT0  (via drill 0.6)
  Top 0.305: v49.28,20.57 50.04,21.34 50.04,23.62 49.57,24.09 U$1.039
  Bottom 0.305: v49.28,20.57 49.28,19.3 46.87,16.76 R5.2
LRCLK_OUT1  (via drill 0.6)
  Top 0.305: v65.79,50.55 66.55,49.78 66.55,29.46 56.39,19.3 47.75,19.3 46.48,20.57 46.48,22.86 46.74,23.11 47.24,23.11 48.07,23.94 U$1.042 | U$17.22 67.53,51.85 68.07,51.31 v68.07,50.55
  Bottom 0.305: v65.79,50.55 v68.07,50.55
N$1
  Top 0.305: R2.1 52.16,42.42 C21.1 49.57,39.83 U$1.16
N$2
  Top 0.305: C22.2 54.95,42.71 R2.2
N$3
  Top 0.305: R3.2 55.12,33.02 54.82,33.07 U$1.022
N$4
  Top 0.305: Q1.3 37.08,40.39
  Top 0.61: Q1.3 37.25,39.74 SJ1.1 35.19,38.8 C12.+
N$5
  Top 0.305: C26.2 58.55,38.61 Y1.2 57.4,37.47 57.4,34.8 57.15,34.54 55.12,34.54 54.14,33.57 U$1.021
N$6
  Top 0.305: R3.1 60.2,33.02 C25.2 60.62,35.85 Y1.1
N$7  (via drill 0.6)
  Top 0.305: U$17.52 71.03,64.43 70.87,64.26 68.07,64.26 v67.31,63.5
  Bottom 0.305: C32.+ 67.31,59.51 v67.31,63.5 67.98,62.83 C19.1
N$8  (via drill 0.6)
  Top 0.305: v32.77,29.21 33.53,28.45 34.8,28.45 36.42,30.07 U$1.063 | U$8.3 29.79,23.69 v30.73,24.64
  Bottom 0.305: v30.73,24.64 31.5,24.64 32.77,25.91 v32.77,29.21
N$9  (via drill 0.6)
  Top 0.305: v34.29,29.97 35.56,29.97 36.16,30.57 U$1.064 | U$8.2 30.66,23.04 v30.73,23.11
  Bottom 0.305: v34.29,29.97 34.29,26.67 v30.73,23.11
N$10
  Top 0.305: SJ4.2 53.85,22.1 54.1,22.35 56.39,22.35 56.64,22.61 56.64,26.67 56.24,27.07 U$1.034
N$12
  Top 0.305: SJ3.2 58.93,27.18 57.78,28.07 U$1.032
N$13
  Top 0.305: SJ2.2 58.42,26.67 57.52,27.57 U$1.033
N$17
  Top 0.61: U$13.20 U$13.19 27.41,8.87 30.99,12.45 30.99,16.51 32.26,17.78 35.81,17.78 40.64,12.95 C29.+ 43.61,9.98 44.4,9.2 U$14.3
N$18
  Top 0.305: R13.2 6.6,74.68 JP5.1
  Top 0.61: IC2.1 19.43,68.96 18.03,67.56 11.68,67.56 9.4,65.28 3.05,65.28 2.54,65.79 2.54,72.14 3.3,72.9 JP5.1
N$19
  Top 0.305: R4.2 33.53,65.53 27.56,71.5 IC2.3 20.76,71.37 19.81,71.37 19.05,72.14 19.05,73.41 17.78,74.68 R13.1
N$20
  Top 0.305: U$15.4 8.22,30.99 C31.2
N$21
  Top 0.305: C31.1 6.26,29.81 JP4.2
N$22
  Top 0.305: U$15.14 14.48,31.49 15.24,30.73 TP2.P$1
N$23
  Top 0.305: U$15.13 14.22,30.99 15.49,29.72 TP3.P$1
N$25
  Top 0.305: IC2.2 24.38,70.23 R10.1 24.76,69.85 28.45,69.85 33.27,65.02 45.21,65.02 46.99,63.25 R7.2
N$26
  Top 0.305: U$17.35 78,57.12 78.99,56.13 78.99,52.32 79.76,51.56 79.76,45.97 80.52,45.21 80.52,43.43 80.01,42.93 SJ5.2
N$27
  Top 0.305: U$17.30 71.53,44.8 73.41,42.93 SJ6.2
N$28  (via drill 0.6)
  Top 0.305: v18.03,72.39 17.65,72.77 IC2.5 12.96,72.77 R12.1 | v27.43,68.33 29.21,68.33 33.02,64.52 44.2,64.52 47.75,60.96 R8.2
  Bottom 0.305: v18.03,72.39 23.37,72.39 v27.43,68.33
N$29  (via drill 0.6)
  Top 0.305: IC2.6 17.14,71.5 v17.78,70.87 | v26.42,67.31 26.92,66.8 29.97,66.8 32.77,64.01 43.43,64.01 46.74,60.71 46.74,59.44 47.5,58.67 R9.2
  Bottom 0.305: v26.42,67.31 22.86,70.87 v17.78,70.87 16,69.09 R11.1
N$30
  Top 0.305: JP7.3 3.56,89.15 3.56,83.82 4.19,83.19 R16.2 4.44,81.03 5.33,81.03 5.59,80.77 5.59,77.72 5.84,77.47 8.13,77.47
  Top 0.406: IC4.7 9.27,78.61 8.13,77.47
N$31
  Top 0.305: JP7.1 5.59,84.84 7.37,83.06 R17.2 13.72,82.42 13.72,78.23 14.48,77.47 15.68,77.47 IC4.1
N$32
  Top 0.305: R12.2 9.78,71 10.03,70.23
  Top 0.61: IC2.7 10.03,70.23 7.62,67.82 JP5.3
N$33
  Top 0.305: R18.2 27.94,75.18 25.4,77.72 20.32,77.72 18.03,80.01 | 18.03,80.01 15.94,80.01 IC4.3 | R17.1 17.27,83.06 17.53,83.31 18.8,83.31 19.56,82.55 19.56,81.53 18.03,80.01
N$34  (via drill 0.6)
  Top 0.305: R19.2 29.46,72.9 25.15,77.22 19.56,77.22 18.29,78.49 v17.78,78.49 15.94,78.49 IC4.2
  Bottom 0.305: R14.1 19.3,76.96 v17.78,78.49
N$35
  Top 0.305: R20.2 30.99,70.61 24.89,76.71 17.78,76.71 17.27,76.2 14.99,76.2 13.21,77.98 13.21,80.01 12.19,81.03 10.73,81.03 IC4.5 7.12,81.15 R16.1
N$36
  Top 0.305: R21.2 32.51,68.33 24.64,76.2 18.03,76.2 17.53,75.69 14.73,75.69 12.7,77.72 12.7,78.99 11.68,80.01 10.73,80.01 IC4.6 9.02,79.88 8.13,78.99 R15.1
N$37
  Top 0.305: C73.+ 70.56,89.21 70.1,89.66 67.12,89.66 U$39.5 65.91,85.72 65.28,85.09 61.21,85.09 59.81,83.69 R33.1
N$38
  Top 0.305: U$38.4 88.7,70.99 R28.2 90.8,70.99 91.19,71.37 91.19,75.95 87.12,80.01 JP9.1
N$39
  Top 0.305: U$38.5 87.5,78.61 86.36,79.76 82.8,79.76 82.04,80.52 JP9.3
  Bottom 0.305: R29.2 81.53,82.04 JP9.3
N$40
  Top 0.305: JP8.1 87,52.45 U$35.4 87.12,56.71 87.12,58.17 86.36,58.93 86.36,63.25 86.99,63.88 R26.1
N$41
  Top 0.305: U$35.5 87,60.07 88.39,58.67 JP8.3 86.11,46.48 81.79,46.48 80.39,47.88 R27.1
N$42
  Top 0.305: U$17.41 77.04,60.12 78.99,58.17 80.14,58.17 R24.2
N$43  (via drill 0.6)
  Top 0.305: U$35.2 84.45,55.24 85.09,54.61 v85.09,53.34
  Bottom 0.305: v85.09,53.34 86.53,53.34 C66.1
N$44  (via drill 0.6)
  Top 0.305: U$38.2 84.96,68.71 v83.82,67.56
  Bottom 0.305: v83.82,67.56 83.06,66.8 83.06,65.37 C65.1
N$45
  Top 0.305: U$17.40 76.77,59.62 78.74,57.66 78.74,57.15 78.99,56.9 81.53,56.9 81.79,57.15 81.79,64.9 R25.2
N$46
  Top 0.305: R23.2 79.76,71.88 80.01,71.63 80.01,68.07 80.52,66.8 80.52,60.96 79.76,60.2 77.72,60.2 77.3,60.62 U$17.42
N$47
  Top 0.305: U$17.43 77.56,61.12 77.98,60.71 79.5,60.71 80.01,61.21 80.01,66.29 78.49,68.33 78.49,69.47 R22.2
N$48
  Top 0.305: U$39.4 68.45,85.72 69.09,86.36 72.9,86.36 74.42,87.38 75.57,87.38 R32.1 76.65,86.94 C72.+
N$49
  Top 0.305: U$35.8 83.06,61.91 83.06,63.25 83.82,64.01 84.58,64.01 84.97,64.39 R25.1 84.97,67.19 85.34,67.56 88.52,67.56 R26.2
N$50
  Top 0.305: R27.2 83.19,53.85 U$35.1 83.12,56.64 82.55,56.64 81.4,55.5 R24.1
N$51
  Top 0.305: U$38.8 83.69,73.28 | 83.69,73.28 82.55,71.88 R23.1 | 83.69,73.28 88.64,73.28 R28.1
N$52  (via drill 0.6)
  Top 0.305: U$38.1 81.6,69.79 R22.1 81.53,69.47 v81.53,67.31
  Bottom 0.305: R29.1 v81.53,67.31
N$53
  Top 0.305: U$39.2 63.37,81.66 62.99,81.28 C67.1
N$54
  Top 0.305: R34.2 76.76,81.66 C72.-
N$55
  Top 0.305: R35.2 69.34,83.09 C73.-
N$56
  Top 0.305: R36.2 57.66,77.22 57.15,77.72 54.86,79.83 C57.+
N$57
  Top 0.305: 73.66,90.42 62.74,90.42 62.1,89.79 U$39.8 | 73.66,90.42 73.66,92.08 R30.2 | 73.66,90.42 73.66,90.3 R32.2
N$58
  Top 0.305: JP10.3 73.15,95.25 70.74,92.83 R30.1
N$59
  Top 0.305: JP10.1 68.07,92.33 R31.1
N$60
  Top 0.305: 62.23,84.07 62.23,83.38 U$39.1 61.4,82.55 58.67,82.55 58.42,82.8 58.42,85.34 59.57,86.49 R33.2 60.96,87.76 60.96,89.92 63.25,92.2 R31.2 | R31.2 65.53,92.2 65.79,92.46 65.4,92.46 R31.2
N$61
  Top 0.305: U$17.54 70.03,72.97 69.85,73.15 69.85,74.08 C76.2 69.76,76.38 C75.2 69.6,76.54 69.6,77.22 69.34,77.47 R35.1
N$62
  Top 0.305: R37.2 57.91,75.18 57.66,75.44 56.31,75.44 C58.+
N$63
  Top 0.305: U$17.53 70.53,73.07 71.37,73.66 71.37,74.08 C76.1 71.46,75.1 71.12,75.44 71.12,76.29 C74.1 71.29,77.38 71.63,77.72 R34.1
N$64
  Top 0.305: R37.1 C60.2 63.67,72.99 64.01,72.64 C77.2 66.29,72.56 66.29,71.88 69.03,69.15 U$17.56
N$65
  Top 0.305: R36.1 C59.1 63.67,76.29 63.75,76.2 66.29,76.2 66.8,75.69 66.8,73.75 C77.1 69.53,71.02 U$17.55
N$66
  Top 0.305: C58.- 52.56,81 | 52.56,81 53.34,81.79 55.88,81.79 56.9,82.8 56.9,86.43 IC5.1 | R38.2 51.77,81.03 52.56,81
N$67
  Top 0.305: R41.2 48.52,87.76 IC5.7 53.98,87.76 54.86,86.87 54.86,83.64 C57.- 54.64,83.31 R39.2
N$68  (via drill 0.6)
  Top 0.305: R38.1 R39.1 47.37,84.71 v48.01,85.34 | 57.08,87.88 IC5.2 58.04,87.76 59.18,88.9 v59.44,88.9
  Bottom 0.305: v59.44,88.9 59.44,88.39 54.86,83.82 49.53,83.82 v48.01,85.34
N$69
  Top 0.305: IC5.6 50.16,89.03 48.77,90.42 R40.2 46.99,90.42 46.74,90.17 46.74,88.39 46.48,88.14 R41.1
N$70
  Top 0.305: JP11.1 51.64,96.52 C106.-
N$71
  Top 0.305: C83.+ 44,76 44.96,76.96 46.61,76.96 R42.2
N$72
  Top 0.305: U$17.58 68.03,68.62 65.79,70.87 64.26,70.87 61.98,73.15 52.07,73.15 50.8,71.88 50.8,71.21 C86.2 50.04,71.12 49.53,71.63 C87.2 48.86,73.87 R43.1
N$73
  Top 0.305: U$17.57 68.53,68.88 66.04,71.37 64.52,71.37 62.23,73.66 52.07,73.66 50.29,75.44 48.14,75.44 R42.1 47.16,73.62 C87.1 C85.1
N$74
  Top 0.305: C84.+ 44.14,81.84 44.7,81.28 44.7,79.5 45.47,78.74 49.02,78.74 49.28,78.49 49.28,77.09 R43.2
N$75
  Top 0.305: C83.- 39.6,79.52 38.86,80.26 31.5,80.26 30.99,80.77 30.99,83.82 31.5,84.33 R45.2 32.64,85.1 R47.2 | 34.36,87.88 IC6.7 32.26,88.01 R47.2 | 30.99,86.74 R47.2
N$76
  Top 0.305: IC6.1 39.6,86.57 C84.- 35.64,81.84 R44.2
N$77
  Top 0.305: R44.1 33.78,82.04 34.04,82.3 34.04,84.07 34.29,84.33 R45.1 36.83,84.33 37.59,85.09 37.59,87.63 37.97,88.01 IC6.2
N$78
  Top 0.305: IC6.6 30.99,89.28 R46.2 29.72,89.15 29.46,88.9 29.46,87.12 29.21,86.87 R47.1
N$79
  Top 0.305: C103.+ 37.98,93.1 37.08,92.2 31.11,92.2 30.16,91.25 | 30.16,91.25 R46.1 | C88.1 30.06,91.35 30.16,91.25
N$80
  Top 0.305: C93.+ 25.98,84.13 R48.2
N$81
  Top 0.305: U$17.60 67.03,68.1 65.28,69.85 63.75,69.85 61.47,72.14 57.15,72.14 54.36,69.34 40.89,69.34 37.34,72.9 37.34,76.11 C97.2 36.23,77.22 35.56,77.22 34.8,77.98 34.04,77.98 33.27,77.22 27.43,77.22 24.13,80.52 | 24.13,80.52 24.13,82.3 24.38,82.55 28.7,82.55 28.96,82.3 R49.1 | 24.13,80.52 23.96,80.52 C96.2
N$82
  Top 0.305: U$17.59 67.53,68.36 65.53,70.36 64.01,70.36 61.72,72.64 56.9,72.64 54.1,69.85 41.15,69.85 37.85,73.15 37.85,77.98 37.08,78.74 36.41,78.74 C97.1 36.23,78.74 33.78,78.74 32.77,77.72 29.46,77.72 28.7,78.49 28.7,78.91 C95.1 28.36,78.74 27.69,78.74 26.16,80.26 R48.1
N$83
  Top 0.305: C94.+ 25.52,86.24 26.42,85.34 27.56,85.34 R49.2
N$84
  Top 0.305: IC7.7 14.86,95.5 14.73,95.38 14.73,93.22 14.1,92.59 R51.2 | R53.2 10.67,97.67 10.67,96.01 11.18,95.5 R51.2 | C93.- 18.49,84.13 18.29,84.33 10.67,84.33 9.65,85.34 9.65,91.06 R51.2
N$85
  Top 0.305: R50.2 13.85,87.75 13.46,88.14 13.46,89.47 IC7.1 13.72,89.73 13.72,90.68 14.48,91.44 19.05,91.44 20.52,89.97 C94.-
N$86
  Top 0.305: R51.1 11.18,87 R50.1 11.05,85.73 11.68,85.09 14.48,85.09 15.24,85.85 15.24,87.88 14.73,88.39 14.73,89.47 IC7.2
N$87
  Top 0.305: IC7.6 R52.2 R53.1
N$88
  Top 0.305: C105.+ 19.87,95.96 | 19.87,95.96 19.05,96.77 19.05,97.67 R52.1 | 19.87,95.96 19.87,94.88 C98.1
N$89
  Top 0.305: C103.- 41.68,96.75 40.39,98.04 31.5,98.04 JP12.1
N$91
  Top 0.305: JP12.3 34.8,94.23 33.78,93.22 27.69,93.22 26.16,94.74 26.16,95.94 C105.-
N$92
  Top 0.305: R40.1 45.34,92.33 46.99,93.98 46.99,95.57 C106.+ 46.98,95.85 C78.1
N$93
  Top 0.305: U$40.16 25.93,44.69 26.16,44.45 26.16,42.42 TP4.P$1
N$94
  Top 0.305: U$40.15 24.71,42.74 TP5.P$1
N$95
  Top 0.305: U$40.12 16.12,45.34 15.24,44.45 TP6.P$1
N$96
  Top 0.305: U$40.13 16.24,44.69 16,44.45 16,42.93 TP7.P$1
N$97
  Top 0.305: R58.1 9.14,54.1 7.87,52.83 7.87,47.75 6.35,46.23 JP13.2 3.05,46.23 2.79,45.97 2.79,39.88 3.05,39.62 6.35,39.62 7.37,40.64 R60.1
N$98
  Top 0.305: R58.2 14.99,54.1 16.6,52.48 U$40.1
N$99
  Top 0.305: R55.2 10.16,35.31 11.18,36.32 11.18,37.47 R54.2 11.05,38.74 11.18,38.86 11.18,41.91 10.41,42.67 9.65,42.67 9.14,43.18 9.14,44.45 9.4,44.7 U$43.2
N$100
  Top 0.305: R59.2 17.44,51.82 U$40.2
N$101
  Top 0.305: R56.1 5.72,35.55 R55.1
N$102
  Top 0.305: JP13.3 6.1,43.69 8.64,46.23 8.64,52.07 8.89,52.32 9.14,52.32 9.65,51.82 R59.1
N$103
  Top 0.305: U$43.4 13.9,43.75 14.22,43.43 14.22,42.29 R60.2
N$104
  Top 0.305: U$40.21 27.23,47.94 Y2.2 29.84,49.78 C113.2
  Bottom 0.305: R61.2 30.48,49.15 Y2.2
N$105
  Top 0.305: TP8.P$1 24.64,52.55 U$40.28
N$106
  Top 0.305: U$40.20 27.52,47.28 Y2.1 31.37,47.24 C114.2
  Bottom 0.305: R61.1 30.48,46.35 Y2.1
N$107
  Top 0.305: U$40.24 26.01,49.88 26.42,50.29 26.42,53.09 27.18,53.85 28.7,53.85 29.97,55.12 31.75,55.12 32.51,54.36 32.51,53.34 34.29,51.56 36.32,51.56 37.08,50.8 37.08,48.77 42.42,43.43 C115.2
N$108  (via drill 0.6)
  Top 0.305: v28.45,55.12 27.43,55.12 25.91,53.59 25.91,50.8 25.65,50.55 24.72,50.55 U$40.25 | C116.2 42.16,42.93 36.58,48.51 36.58,50.55 36.07,51.05 34.04,51.05 v30.99,54.1
  Bottom 0.305: v28.45,55.12 29.72,54.1 v30.99,54.1
N$110
  Top 0.61: LED3.A 50.01,56.16 49.53,56.64 47.24,56.64 45.72,58.17 45.72,59.69 43.69,61.72 43.06,61.72 R63.2
N$111  (via drill 0.6)
  Top 0.305: v35.81,52.58 35.58,52.58 LED4.A
  Bottom 0.305: R64.2 35.56,53.09 v35.81,52.58
N$112
  Top 0.305: R66.2 63.37,16.16 LED1.A
N$113
  Top 0.305: LED2.A 63.27,19.91 R65.2
REG_DRIVE
  Top 0.305: R1.2 38.61,43.69 40.64,41.66 40.64,40.64 39.44,39.44 Q1.1 39.42,39.37 39.88,39.12 41.15,37.85 41.66,37.85 43.07,36.43 U$1.3
SCL  (via drill 0.6)
  Top 0.305: U$15.7 11.19,29.22 10.67,28.7 v9.91,28.7 | U$17.34 77.74,56.62 77.98,56.39 v77.98,54.61 | U$8.8 23.16,22.39 22.86,22.1 22.86,19.3 v23.11,19.05 | v57.91,29.21 57.27,28.57 U$1.031 | v52.58,13.21 54.1,13.21 56.13,15.24 JP6.4
  Bottom 0.305: v9.91,28.7 9.91,28.19 10.92,27.18 10.92,24.13 14.99,20.07 21.59,20.07 22.61,19.05 v23.11,19.05 24.13,19.05 25.15,20.07 32.51,20.07 38.1,14.48 51.56,14.48 v52.58,13.21 | v77.98,54.61 77.98,48.77 73.91,44.7 73.91,36.58 66.55,29.21 v57.91,29.21 57.91,16 JP6.4
SDA  (via drill 0.6)
  Top 0.305: v11.68,28.45 U$15.8 | v55.37,29.97 54.47,29.07 U$1.030 | U$17.31 72.03,51.67 v72.9,50.8 | U$8.7 21.77,23.04 21.08,22.35 v21.08,21.34
  Bottom 0.305: v11.68,28.45 11.43,28.19 11.43,24.38 15.24,20.57 19.3,20.57 20.07,21.34 v21.08,21.34 22.1,21.34 22.86,20.57 32.77,20.57 38.35,14.99 54.61,14.99 | v72.9,50.8 73.41,50.29 73.41,36.83 67.06,30.48 55.88,30.48 v55.37,29.97 55.37,29.72 56.9,28.19 56.9,22.61 57.15,22.35 57.15,17.53 54.61,14.99 | JP6.2 57.66,10.16 54.61,13.21 54.61,14.99
SPDIF-OUT
  Top 0.305: C115.1 43.43,37.59 44.07,36.96 U$1.5
SPDIFIN
  Top 0.305: C116.1 42.16,38.1 43.57,36.69 U$1.4
VBUS  (via drill 0.6)
  Top 0.305: U$40.9 15.54,47.28 v15.24,47.24 | R54.1 8.25,38.74 v7.62,39.37
  Route2 0.305: v15.24,47.24 11.68,47.24 5.59,41.15 JP13.4 6.35,39.37 v7.62,39.37
  Bottom 0.305: R57.2 8.38,40.13 v7.62,39.37
VCC  (via drill 0.6)
  Top 0.305: U$39.3 64.64,80.56 C68.1 | C79.2 47.08,86.61 50.8,86.61 51.18,86.49 IC5.8 51.76,85.28 v51.56,85.09 | IC6.8 35.69,86.74 v36.32,86.11
  Top 0.406: v84.33,58.67 85.09,58.67 85.72,58.04 U$35.3 | U$38.3 86.23,70.99 v85.09,72.14 | IC2.8 10.79,68.96 v9.4,67.56 | C101.+ 72.82,71.3 v71.88,70.36 | IC4.8 9.27,76.33 v7.62,76.2 | IC7.8 12.25,94.8 v12.19,94.74 | U$39.3 64.64,79.88 64.77,79.76 65.28,79.76 v66.29,80.77
  Top 0.61: R63.1 39.12,61.98 38.1,60.96 38.1,56.39
  Top 0.813: JP1.3 7.37,57.15 12.45,62.23 v25.65,62.23 v28.7,59.18 31.5,56.39 38.1,56.39 39.37,55.12 C1.1
  Route15 0.406: v71.88,70.36 71.88,72.14 71.63,72.39
  Route15 0.61: v85.09,72.14 83.82,73.41 74.93,73.41 73.91,72.39 71.63,72.39 66.8,72.39 65.53,71.12 56.9,71.12 53.59,67.82 53.59,60.2 48.51,55.12 C1.1 | v7.62,76.2 12.19,76.2 | 12.19,76.2 24.89,76.2 29.46,71.63 29.46,66.04 v25.65,62.23 | v12.19,94.74 12.19,76.2 | v36.32,86.11 36.83,85.6 36.83,81.79 | 36.83,81.79 48.26,81.79 v51.56,85.09 54.86,81.79 63.5,81.79 64.52,80.77 v66.29,80.77 | v28.7,59.18 28.7,59.69 32.51,63.5 32.51,76.96 36.83,81.79
  Route15 0.813: v85.09,72.14 85.09,70.1 85.85,69.34 85.85,66.8 84.33,65.28 v84.33,58.67
  Bottom 0.305: v36.32,86.11 35.05,86.11 C50.1 | C62.2 83.48,56.3 84.33,57.15 v84.33,58.67
  Bottom 0.406: C20.2 v85.09,72.14 | v9.4,67.56 13.03,63.93 C102.+ 13.03,61.2 C55.1 11.68,59.86 11.68,56.9 10.92,56.13 5.84,56.13 JP1.3
  Bottom 0.61: C99.2 7.11,76.45 v7.62,76.2 | C89.2 v12.19,94.74 11.68,94.23 C53.+ | C46.+ 66.47,80.95 v66.29,80.77
VNEG  (via drill 0.6)
  Top 0.305: IC5.4 56.96,91.59 C80.1 56.13,91.95 v55.12,92.96 | U$35.6 85.72,63.63 87.12,65.02 v87.12,65.79 | IC6.4 39.56,90.42 C56.2 42.16,90.08 42.16,91.44 v41.4,92.2 | U$39.6 64.64,86.49 v64.52,86.36
  Top 0.406: U$38.6 86.23,77.34 v86.11,77.47 | C48.1 20.57,66.8 v20.32,66.55 18.54,64.77 10.92,64.77 10.16,64.01 5.33,64.01 4.83,63.5 JP1.1 | v21.08,74.42 21.08,72.97 IC2.4 | C81.- 78.56,78.05 v79.5,78.99 | v19.3,88.9 18.1,88.9 IC7.4
  Top 0.61: IC4.4 17.4,81.15 v18.29,82.04 | C52.- 56.31,94.16 v55.12,92.96
  Top 0.813: JP1.1 10.41,62.23 11.68,63.5 26.92,63.5 v28.57,61.85 31.75,58.67 C2.2
  Route15 0.406: v20.32,66.55 20.32,73.66 v21.08,74.42 | v79.5,78.99 79.5,74.68
  Route15 0.61: v86.11,77.47 86.11,76.96 83.82,74.68 79.5,74.68 74.68,74.68 73.41,73.41 66.29,73.41 65.02,72.14 56.39,72.14 52.58,68.33 52.58,60.71 50.29,58.42 44.7,58.42 43.43,59.69 37.08,59.69 36.07,58.67 C2.2 | 30.73,82.04 v18.29,82.04 18.29,87.88 v19.3,88.9 | 30.73,82.04 30.73,64.01 v28.57,61.85 | v64.52,86.36 64.52,92.46 63.25,93.73 55.88,93.73 v55.12,92.96 48.26,92.96 46.48,94.74 42.93,94.74 41.4,93.22 v41.4,92.2 41.15,92.46 33.78,92.46 30.73,89.41 30.73,82.04
  Route15 0.813: v87.12,65.79 87.12,76.45 v86.11,77.47
  Bottom 0.305: C49.1 87.29,76.29 v86.11,77.47 | C100.1 18.03,90.17 v19.3,88.9 | C64.2 64.35,86.19 v64.52,86.36 | R64.1 34.41,57.53 C2.2
  Bottom 0.406: C90.1 88.65,64.26 v87.12,65.79 | C82.- 24.13,73.15 23.62,73.66 21.84,73.66 v21.08,74.42 | C70.1 17.78,81.53 v18.29,82.04
  Bottom 0.61: C54.- 20.5,87.71 v19.3,88.9

## Text on the board
tPlace: L PC In R | DVD In | - G + | Aux In | Line Out | R | - G + | L | XLR Out 2 | Phones | L | R | -9V | GND | +9V | USB | GND | XLR Out 1 | D+ | - G + | D- | H / L | I2S In | VB | A0 | A1 | GND | DATA | Radio | LRCLK | FM | BCLK | 3.3V / Analog | A1 | L | A0 | AM | H | L | Boot | Bluetooth | SSP | H | L | SCL | GND | RX | +5V | TX | 3.3V / Digital | SDA | CTS | GND | RTS | Tristan Honscheid | GND | Dec 2014 | Digital DSP Audio Router